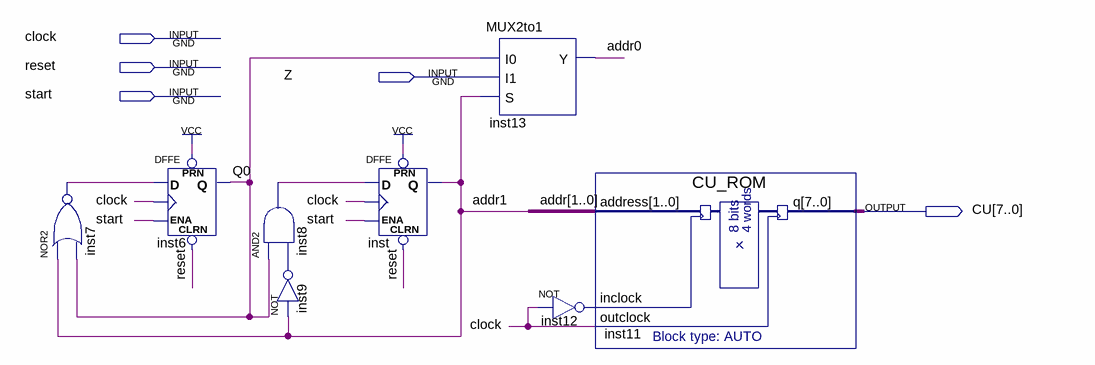
[diagram p0: schematic sheet]
// Quartus schematic ControlUnit.bdf as structural Verilog: 8 symbols, 5 pins
module ControlUnit (
  input  clock,
  input  reset,
  input  Z,
  input  start,
  output [7:0] CU
);

  wire inst7_out, inst8_out, inst9_out, inst12_out, Q0;
  wire [1:0] addr;

  nor inst7 (inst7_out, addr[1], Q0);
  DFFE inst6 (.PRN(1'b1), .CLRN(reset), .D(inst7_out), .CLK(clock), .ENA(start), .Q(Q0));
  and inst8 (inst8_out, Q0, inst9_out);
  not inst9 (inst9_out, addr[1]);
  DFFE inst (.PRN(1'b1), .CLRN(reset), .D(inst8_out), .CLK(clock), .ENA(start), .Q(addr[1]));
  MUX2to1 inst13 (.I0(Q0), .I1(Z), .S(addr[1]), .Y(addr[0]));
  CU_ROM inst11 (.address(addr), .inclock(inst12_out), .outclock(clock), .q(CU));
  not inst12 (inst12_out, clock);
endmodule
